# Altium project AVR_Atmega32.PrjPcb
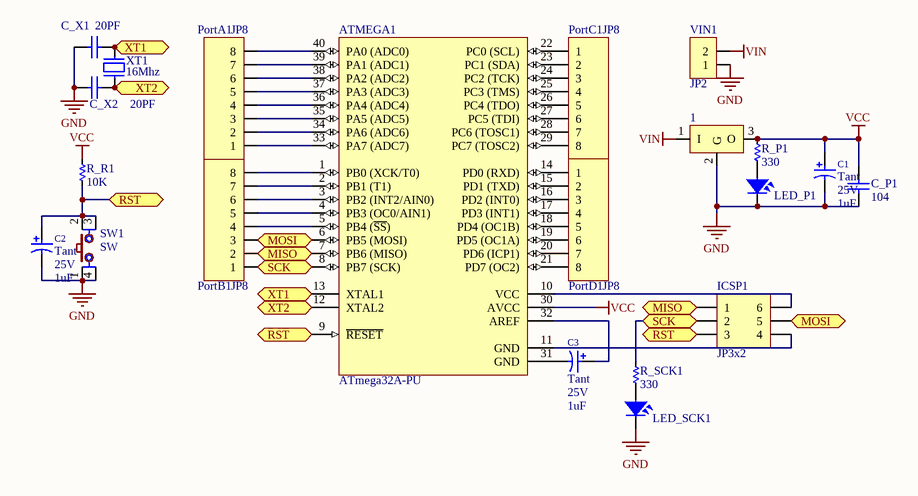
[diagram p0: Sheet1.SchDoc]
1 sheet, 21 parts. Net scope: flat (ports and power ports of the same name join across sheets).
Board files: PCB2.PcbDoc, PCB_EX.PcbDoc, PCB1.PcbDoc

## Sheet Sheet1.SchDoc
size A

### Parts
1  LM78xx  [TO252-123]  (value not drawn)
ATMEGA1  ATmega32A-PU  [DIP40/W0.6]
C1  Capacitor Type: Tant  Volt: 25V  [Cap_smd_4_3MM_N]  (hidden comment: 1uF)
C2  Capacitor Type: Tant  Volt: 25V  [Cap_smd_4_3MM_N]  (hidden comment: 1uF)
C3  Capacitor Type: Tant  Volt: 25V  [Cap_smd_4_3MM_N]  (hidden comment: 1uF)
C_P1  value 104  [C-NP-0805]  (hidden comment: Cap Non-pol)
C_X1  value 20PF  [C-NP-0805]  (hidden comment: Cap Non-pol)
C_X2  value 20PF  [C-NP-0805]  (hidden comment: Cap Non-pol)
ICSP1  JP3x2  [JP3-D2T]
LED_P1  LED  [LED-1206-Blue]  (value not drawn)
LED_SCK1  LED  [LED-1206-Blue]  (value not drawn)
PortA1  JP8  [JP8-D1T]
PortB1  JP8  [JP8-D1T]
PortC1  JP8  [JP8-D1T]
PortD1  JP8  [JP8-D1T]
R_P1  330  [RES-SMD-1206]
R_R1  10K  [RES-SMD-1206]
R_SCK1  330  [RES-SMD-1206]
SW1  SW  [SW2-DIP]
VIN1  JP2  [JP2-C1T]
XT1  16Mhz  [XT2]

### Ports
MISO, MOSI, RST, SCK, XT1, XT2

### Nets
GND: 1.2(G) C1.2 C2.2 C_P1.1 C_X1.1 C_X2.1 LED_P1.2 LED_SCK1.2 SW1.1 SW1.4 VIN1.1
VCC: 1.3(O) ATMEGA1.30(AVCC) C1.1 C_P1.2 R_P1.1 R_R1.1
VIN: 1.1(I) VIN1.2
NetATMEGA1_1: ATMEGA1.1(PB0_(XCK/T0)) PortB1.8
NetATMEGA1_2: ATMEGA1.2(PB1_(T1)) PortB1.7
NetATMEGA1_3: ATMEGA1.3(PB2_(INT2/AIN0)) PortB1.6
NetATMEGA1_4: ATMEGA1.4(PB3_(OC0/AIN1)) PortB1.5
NetATMEGA1_5: ATMEGA1.5(PB4_(~{SS})) PortB1.4
NetATMEGA1_6: ATMEGA1.6(PB5_(MOSI)) ICSP1.5 PortB1.3 ; port MOSI
NetATMEGA1_7: ATMEGA1.7(PB6_(MISO)) ICSP1.1 PortB1.2 ; port MISO
NetATMEGA1_8: ATMEGA1.8(PB7_(SCK)) ICSP1.2 PortB1.1 R_SCK1.1 ; port SCK
NetATMEGA1_9: ATMEGA1.9(~{RESET}) C2.1 ICSP1.3 R_R1.2 SW1.2 SW1.3 ; port RST
NetATMEGA1_10: ATMEGA1.10(VCC) ICSP1.6
NetATMEGA1_11: ATMEGA1.11(GND) ICSP1.4
NetATMEGA1_12: ATMEGA1.12(XTAL2) C_X2.2 XT1.2 ; port XT2
NetATMEGA1_13: ATMEGA1.13(XTAL1) C_X1.2 XT1.1 ; port XT1
NetATMEGA1_14: ATMEGA1.14(PD0_(RXD)) PortD1.1
NetATMEGA1_15: ATMEGA1.15(PD1_(TXD)) PortD1.2
NetATMEGA1_16: ATMEGA1.16(PD2_(INT0)) PortD1.3
NetATMEGA1_17: ATMEGA1.17(PD3_(INT1)) PortD1.4
NetATMEGA1_18: ATMEGA1.18(PD4_(OC1B)) PortD1.5
NetATMEGA1_19: ATMEGA1.19(PD5_(OC1A)) PortD1.6
NetATMEGA1_20: ATMEGA1.20(PD6_(ICP1)) PortD1.7
NetATMEGA1_21: ATMEGA1.21(PD7_(OC2)) PortD1.8
NetATMEGA1_22: ATMEGA1.22(PC0_(SCL)) PortC1.1
NetATMEGA1_23: ATMEGA1.23(PC1_(SDA)) PortC1.2
NetATMEGA1_24: ATMEGA1.24(PC2_(TCK)) PortC1.3
NetATMEGA1_25: ATMEGA1.25(PC3_(TMS)) PortC1.4
NetATMEGA1_26: ATMEGA1.26(PC4_(TDO)) PortC1.5
NetATMEGA1_27: ATMEGA1.27(PC5_(TDI)) PortC1.6
NetATMEGA1_28: ATMEGA1.28(PC6_(TOSC1)) PortC1.7
NetATMEGA1_29: ATMEGA1.29(PC7_(TOSC2)) PortC1.8
NetATMEGA1_31: ATMEGA1.31(GND) C3.2
NetATMEGA1_32: ATMEGA1.32(AREF) C3.1
NetATMEGA1_33: ATMEGA1.33(PA7_(ADC7)) PortA1.1
NetATMEGA1_34: ATMEGA1.34(PA6_(ADC6)) PortA1.2
NetATMEGA1_35: ATMEGA1.35(PA5_(ADC5)) PortA1.3
NetATMEGA1_36: ATMEGA1.36(PA4_(ADC4)) PortA1.4
NetATMEGA1_37: ATMEGA1.37(PA3_(ADC3)) PortA1.5
NetATMEGA1_38: ATMEGA1.38(PA2_(ADC2)) PortA1.6
NetATMEGA1_39: ATMEGA1.39(PA1_(ADC1)) PortA1.7
NetATMEGA1_40: ATMEGA1.40(PA0_(ADC0)) PortA1.8
NetLED_P1_1: LED_P1.1 R_P1.2
NetLED_SCK1_1: LED_SCK1.1 R_SCK1.2

### Library data of the parts
1 = LM78xx: Positive Voltage Regulator; Note: Tab is connected to pin 3 (GND).; Published: 24-Aug-2001; LatestRevisionDate: 17-Jul-2002; LatestRevisionNote: Re-released for DXP Platform.; DatasheetVersion: Apr-1994; PackageVersion: Jul-1998; PackageReference: ISOWATT220AB; Publisher: Altium Limited; PackageDescription: TO, Thru-Hole, Vertical, Heatsink Mounted; 3 In-Line Leads; Pitch 2.54 mm; Pin sequence 1, 3, 2; ComponentLink1Description: Manufacturer Link; ComponentLink1URL: http://www.st.com/; ComponentLink2Description: Datasheet; ComponentLink2URL: http://www.st.com/stonline/products/literature/ds/2146/l78m05c.pdf
ATMEGA1 = ATmega32A-PU: 8-Bit AVR Microcontroller with 32K Bytes of In-System Programmable Flash Memory; Published: 17-Sep-2003; DatasheetVersion: 2503C-AVR-10/02; PackageVersion: revB, Sep-2001; PackageReference: 40P6; Publisher: Altium Limited; PackageDescription: 40-lead (0.600"/15.24mm Wide) Plastic Dual Inline Package (PDIP); Supplier 1: Digi-Key; Supplier Part Number 1: ATMEGA32-16PC-ND; Supplier 2: Mouser; Supplier Part Number 2: 556-ATMEGA32-16PC; Code_JEDEC: MS-011-AC; ComponentLink1Description: Datasheet; ComponentLink1URL: http://www.atmel.com/dyn/resources/prod_documents/doc2503.pdf; ComponentLink2Description: Atmel.com Home; ComponentLink2URL: http://www.atmel.com
C1-C3 = Cap_Pol: Polarized Capacitor; Manufacturer: FARNELL; AEMS Code: 2100110; Vendor: Digikey; Published: 13-April-2009; Publisher: Hoang Nguyen; ComponentLink1Description: Digikey Part Link; ComponentLink2Description: Open Datasheet; ComponentLink2URL: H:\LIBRARY\LIBRARY.Datasheet\; Value: 1uF
C_P1 C_X1 C_X2 = Cap Non-pol: Non-polarized Capacitor; Published: 8-Jun-2000; LatestRevisionDate: 17-Jul-2002; LatestRevisionNote: Re-released for DXP Platform.; PackageReference: RAD-0.3; Publisher: Altium Limited
ICSP1 = JP3x2: WR-PHD 2.54 mm Dual Socket Header; Manufacturer: W¨¹rth Elektronik eiSos GmbH; partNo: 61300621821; ComponentLink1 Description: Manufacturer; ComponentLink2 Description: Datasheet; NoPins: 06; Created Date: 29 March 2013; ComponentLink1URL: http://www.we-online.com; ComponentLink2URL: http://katalog.we-online.de/em/datasheet/6130xx21821.pdf; Created by: Karrer Zheng
LED_P1 LED_SCK1 = LED SMD: Value: LED 3 - 5 ly 2 Colour
PortA1 PortB1 PortC1 PortD1 = JP8: WR-PHD 2.54 mm Angled Socket Header; Manufacturer: W¨¹rth Elektronik eiSos GmbH; partNo: 613008143121; ComponentLink1 Description: Manufacturer; ComponentLink2 Description: Datasheet; NoPins: 08; Created Date: 29 March 2013; ComponentLink1URL: http://www.we-online.com; ComponentLink2URL: http://katalog.we-online.de/em/datasheet/6130xx143121.pdf; Created by: Karrer Zheng
R_P1 R_R1 R_SCK1 = Res-SMD: Resistor; Manufacturer: Generic Components; Class: Passive; Published: 08/06/2000; Publisher: Altium Hobart Technology Centre
SW1 = SW4: Switch button 4 pin; Value: Button chip 4 pin
VIN1 = JP2: WR-PHD 2.54 mm Angled Socket Header; Manufacturer: W¨¹rth Elektronik eiSos GmbH; partNo: 613002143121; ComponentLink1 Description: Manufacturer; ComponentLink2 Description: Datasheet; NoPins: 02; Created Date: 29 March 2013; ComponentLink1URL: http://www.we-online.com; ComponentLink2URL: http://katalog.we-online.de/em/datasheet/6130xx143121.pdf; Created by: Karrer Zheng
XT1 = XT2: Crystal, 32.768 KHz, -40 to 85 degC, 3.2 x 1.5 x 0.9 mm SMD; Value: 4Mhz